# EAGLE schematic EC544 (EAGLE 9.6.2)
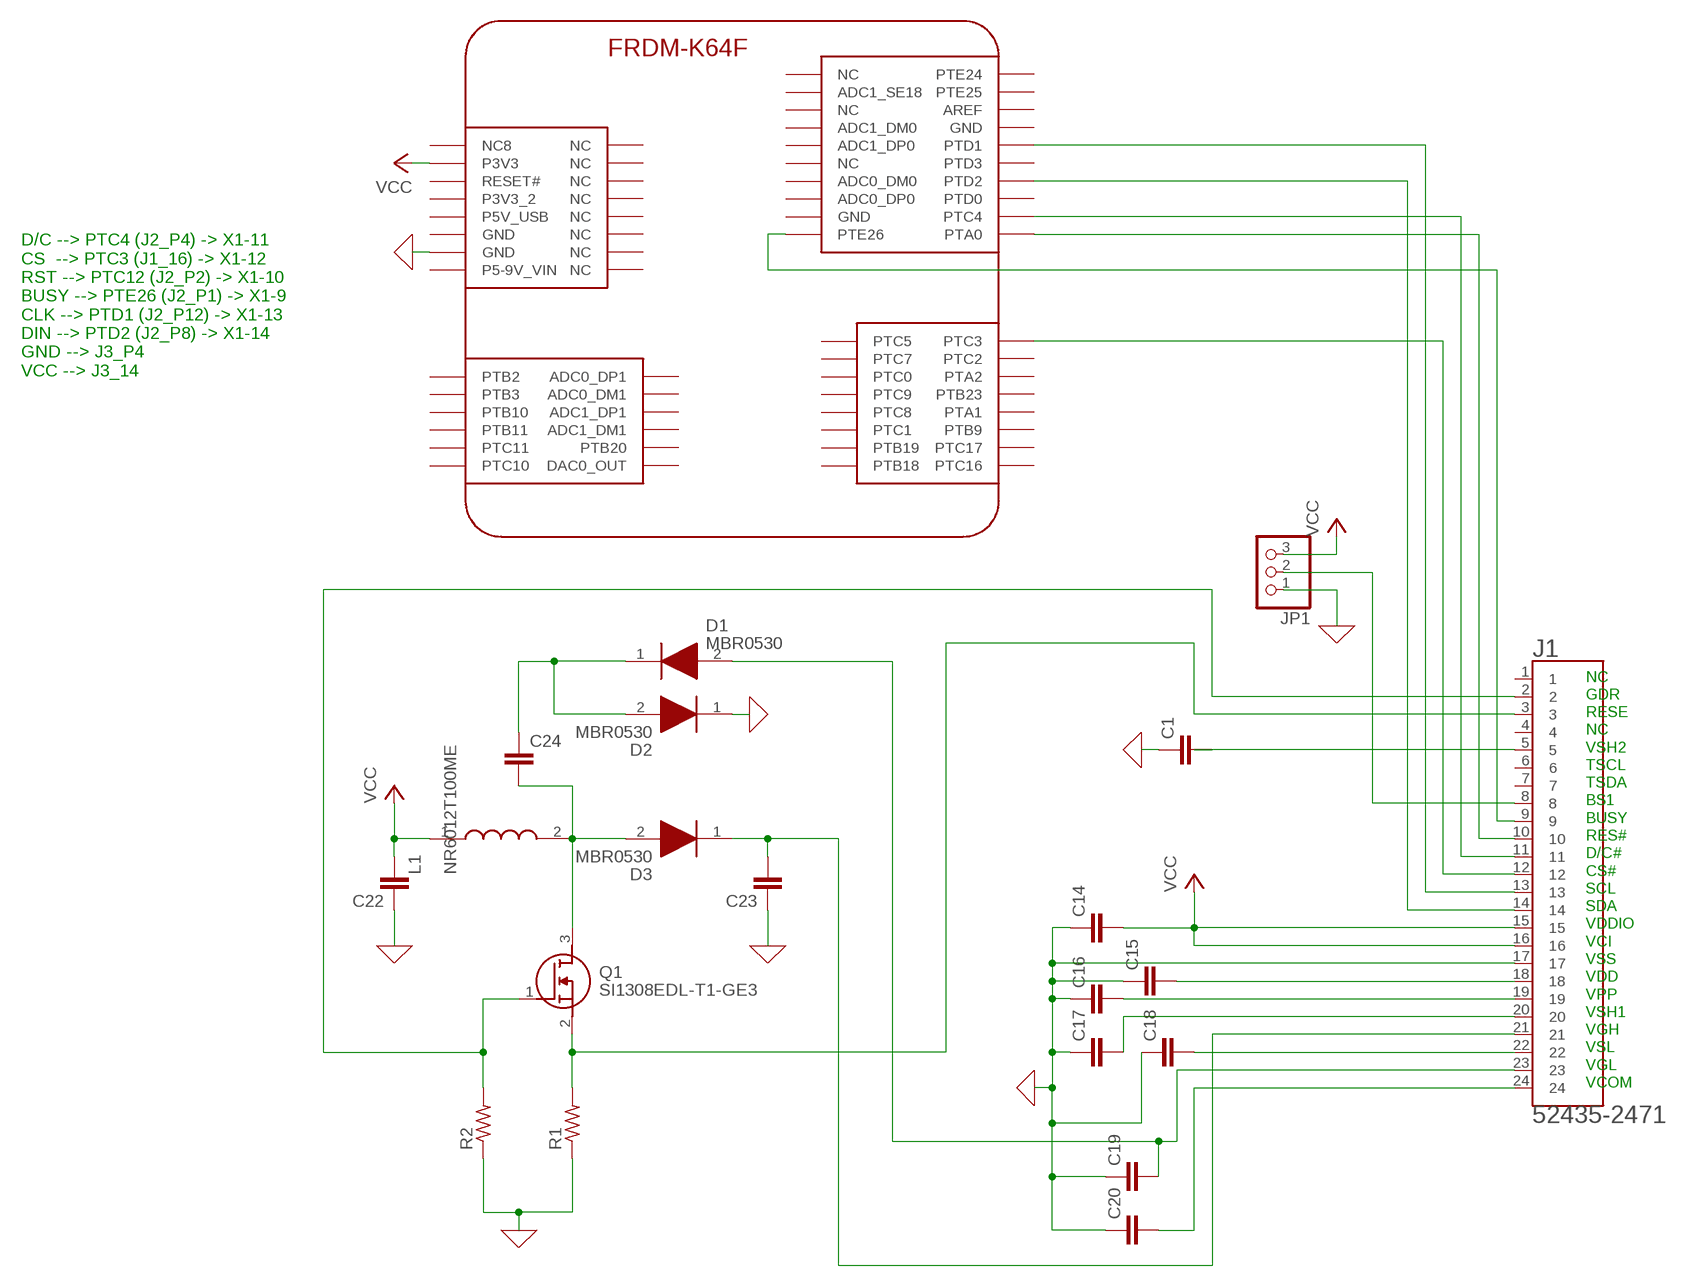
[diagram p0: schematic, sheet 1]

## Parts
C1  C-EUC0805  [C0805]
C14  C-EUC0805  [C0805]
C15  C-EUC0805  [C0805]
C16  C-EUC0805  [C0805]
C17  C-EUC0805  [C0805]
C18  C-EUC0805  [C0805]
C19  C-EUC0805  [C0805]
C20  C-EUC0805  [C0805]
C22  C-EUC0805  [C0805]
C23  C-EUC0805  [C0805]
C24  C-EUC0805  [C0805]
D1  MBR0530  [SOD3716X135N]
D2  MBR0530  [SOD3716X135N]
D3  MBR0530  [SOD3716X135N]
FRDM1  FRDM-K64FNORMAL  [FRDM_K64F]
J1  52435-2471  [MOLEX_52435-2471]
JP1  PINHD-1X3  [1X03]
L1  NR6012T100ME  [NR6012T100ME]
Q1  SI1308EDL-T1-GE3  [SOT65P210X110-3N]
R1  R-US_0204/5  [0204/5]
R2  R-US_0204/5  [0204/5]

## Nets
0: C1.1 C14.1 C15.1 C16.1 C17.1 C18.1 C19.1 C20.1 C22.1 C23.1 D2.1(K) FRDM1.J3.14(GND) J1.17 JP1.1 R1.1 R2.1 ; supply symbol labelled GND
N$1: C1.2 J1.5
N$2: J1.8 JP1.2
N$3: C24.1 D1.1(K) D2.2(A)
N$4: C15.2 J1.18
N$5: C17.2 J1.20
N$6: C18.2 J1.22
N$7: C19.2 D1.2(A) J1.23
N$8: C20.2 J1.24
N$9: C24.2 D3.2(A) L1.2 Q1.3(D)
N$10: C23.2 D3.1(K) J1.21
N$11: J1.2 Q1.1(G) R2.2
N$12: J1.3 Q1.2(S) R1.2
N$13: C16.2 J1.19
N$14: FRDM1.J2.1(PTE26) J1.9
N$16: FRDM1.J2.2(PTA0) J1.10
N$17: FRDM1.J2.4(PTC4) J1.11
N$18: FRDM1.J1.16(PTC3) J1.12
N$19: FRDM1.J2.12(PTD1) J1.13
N$20: FRDM1.J2.8(PTD2) J1.14
VCC: C14.2 C22.2 FRDM1.J3.4(P3V3) J1.15 J1.16 JP1.3 L1.1
Unconnected: FRDM1.J1.1(PTB18) FRDM1.J1.2(PTC16) FRDM1.J1.3(PTB19) FRDM1.J1.4(PTC17) FRDM1.J1.5(PTC1) FRDM1.J1.6(PTB9) FRDM1.J1.7(PTC8) FRDM1.J1.8(PTA1) FRDM1.J1.9(PTC9) FRDM1.J1.10(PTB23) FRDM1.J1.11(PTC0) FRDM1.J1.12(PTA2) FRDM1.J1.13(PTC7) FRDM1.J1.14(PTC2) FRDM1.J1.15(PTC5) FRDM1.J2.3(GND) FRDM1.J2.5(ADC0_DP0) FRDM1.J2.6(PTD0) FRDM1.J2.7(ADC0_DM0) FRDM1.J2.9(NC) FRDM1.J2.10(PTD3) FRDM1.J2.11(ADC1_DP0) FRDM1.J2.13(ADC1_DM0) FRDM1.J2.14(GND) FRDM1.J2.15(NC) FRDM1.J2.16(AREF) FRDM1.J2.17(ADC1_SE18) FRDM1.J2.18(PTE25) FRDM1.J2.19(NC) FRDM1.J2.20(PTE24) FRDM1.J3.1(NC) FRDM1.J3.2(NC) FRDM1.J3.3(NC) FRDM1.J3.5(NC) FRDM1.J3.6(RESET#) FRDM1.J3.7(NC) FRDM1.J3.8(P3V3_2) FRDM1.J3.9(NC) FRDM1.J3.10(P5V_USB) FRDM1.J3.11(NC) FRDM1.J3.12(GND) FRDM1.J3.13(NC) FRDM1.J3.15(NC8) FRDM1.J3.16(P5-9V_VIN) FRDM1.J4.1(ADC0_DP1) FRDM1.J4.2(PTB2) FRDM1.J4.3(ADC0_DM1) FRDM1.J4.4(PTB3) FRDM1.J4.5(ADC1_DP1) FRDM1.J4.6(PTB10) FRDM1.J4.7(ADC1_DM1) FRDM1.J4.8(PTB11) FRDM1.J4.9(PTB20) FRDM1.J4.10(PTC11) FRDM1.J4.11(DAC0_OUT) FRDM1.J4.12(PTC10) J1.1 J1.4 J1.6 J1.7

## Notes on the sheet
- D/C --> PTC4 (J2_P4) -> X1-11
  CS  --> PTC3 (J1_16) -> X1-12
  RST --> PTC12 (J2_P2) -> X1-10
  BUSY --> PTE26 (J2_P1) -> X1-9
  CLK --> PTD1 (J2_P12) -> X1-13
  DIN --> PTD2 (J2_P8) -> X1-14
  GND --> J3_P4
  VCC --> J3_14
- NC
  GDR
  RESE
  NC
  VSH2
  TSCL
  TSDA
  BS1
  BUSY
  RES#
  D/C#
  CS#
  SCL
  SDA
  VDDIO
  VCI
  VSS
  VDD
  VPP
  VSH1
  VGH
  VSL
  VGL
  VCOM

## Library data of the parts
C1 C14-C20 C22-C24 = rcl:C-EU: CAPACITOR, European symbol; SPICEPREFIX: C
D1-D3 = MBR0530:MBR0530: ON SEMICONDUCTOR - MBR0530 - DIODE, SCHOTTKY, 0.5A, 30V, SOD-123 Source: Datasheet <http://www.onsemi.com/pub/Collateral/MBR0530T1-D.PDF>; ARROW_PART_NUMBER: MBR0530; ARROW_PRICE-STOCK: https://www.arrow.com/en/products/mbr0530/on-semiconductor?region=nac; DESCRIPTION: ON SEMICONDUCTOR - MBR0530 - DIODE, SCHOTTKY, 0.5A, 30V, SOD-123; HEIGHT: 1.35mm; MANUFACTURER_NAME: ON Semiconductor; MANUFACTURER_PART_NUMBER: MBR0530; MOUSER_PART_NUMBER: 512-MBR0530; MOUSER_PRICE-STOCK: https://www.mouser.co.uk/ProductDetail/ON-Semiconductor-Fairchild/MBR0530?qs=VOMQJJE%252BBNniwJKcE3T43Q%3D%3D
FRDM1 = Freedom:FRDM-K64F: For creating FRDM-K64F shields
J1 = 52435-2471:52435-2471: Conn FFC/FPC Connector SKT 24 POS 0.5mm Solder RA SMD Embossed T/R Check availability <https://pricing.snapeda.com/parts/52435-2471/Molex/view-part?ref=eda>; AVAILABILITY: In Stock; DESCRIPTION: 24 Position FFC, FPC Connector Contacts, Top 0.020 (0.50mm) Surface Mount, Right Angle; MF: Molex; MP: 52435-2471; PACKAGE: None; PRICE: None; PURCHASE-URL: https://pricing.snapeda.com/search/part/52435-2471/?ref=eda
JP1 = pinhead:PINHD-1X3: PIN HEADER
L1 = NR6012T100ME:NR6012T100ME: NR6012T100ME Source: Datasheet <https://www.mouser.com/datasheet/2/396/wound04_e-1290968.pdf>; ARROW_PART_NUMBER: NR6012T100ME; ARROW_PRICE-STOCK: https://www.arrow.com/en/products/nr6012t100me/taiyo-yuden; DESCRIPTION: NR6012T100ME; HEIGHT: 1.2mm; MANUFACTURER_NAME: TAIYO YUDEN; MANUFACTURER_PART_NUMBER: NR6012T100ME; MOUSER_PART_NUMBER: 963-NR6012T100ME; MOUSER_PRICE-STOCK: https://www.mouser.com/Search/Refine.aspx?Keyword=963-NR6012T100ME
Q1 = Si1308EDL-T1-GE3:SI1308EDL-T1-GE3: MOSFET N-Ch 30V 1.5A TrenchFET SC70 Vishay Si1308EDL-T1-GE3 N-channel MOSFET Transistor, 1.5 A, 30 V, 3-Pin SC-70 Source: Datasheet <https://componentsearchengine.com/Datasheets/1/SI1308EDL-T1-GE3.pdf>; ARROW_PART_NUMBER: SI1308EDL-T1-GE3; ARROW_PRICE-STOCK: https://www.arrow.com/en/products/si1308edl-t1-ge3/vishay?region=nac; DESCRIPTION: MOSFET N-Ch 30V 1.5A TrenchFET SC70 Vishay Si1308EDL-T1-GE3 N-channel MOSFET Transistor, 1.5 A, 30 V, 3-Pin SC-70; HEIGHT: 1.1mm; MANUFACTURER_NAME: Vishay; MANUFACTURER_PART_NUMBER: Si1308EDL-T1-GE3; MOUSER_PART_NUMBER: 78-SI1308EDL-T1-GE3; MOUSER_PRICE-STOCK: https://www.mouser.co.uk/ProductDetail/Vishay-Semiconductors/SI1308EDL-T1-GE3?qs=bX1%252BNvsK%2FBramh9tgpOaEw%3D%3D
R1 R2 = rcl:R-US_: RESISTOR, American symbol; SPICEPREFIX: R